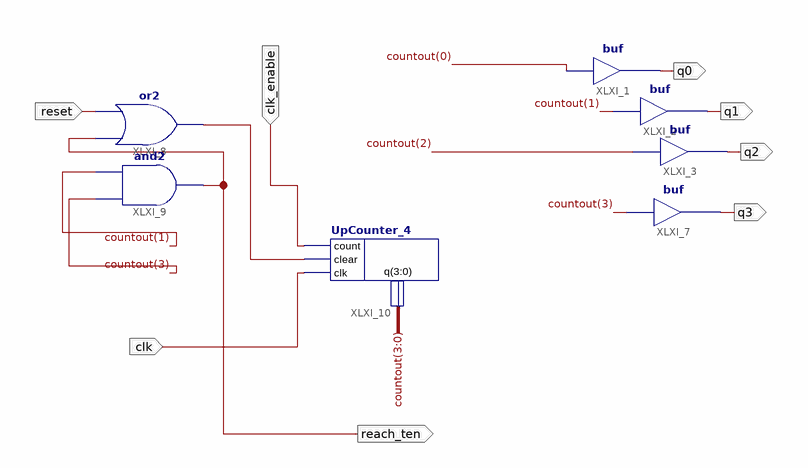
[diagram p0: schematic sheet 1]
// Xilinx ISE schematic Upcount_Modulo_10.sch (spartan3e) as structural Verilog: 7 symbols, 8 ports
module Upcount_Modulo_10 (
  input  clk,
  input  clk_enable,
  input  reset,
  output q0,
  output q1,
  output q2,
  output q3,
  output reach_ten
);

  wire XLXN_24;
  wire [3:0] countout;

  buf XLXI_1 (q0, countout[0]);
  buf XLXI_2 (q1, countout[1]);
  buf XLXI_3 (q2, countout[2]);
  buf XLXI_7 (q3, countout[3]);
  or XLXI_8 (XLXN_24, reach_ten, reset);
  and XLXI_9 (reach_ten, countout[3], countout[1]);
  UpCounter_4 XLXI_10 (.clk(clk), .q(countout), .clear(XLXN_24), .count(clk_enable));
endmodule
